# EAGLE design Edin_Usher_V2_0_discreto (EAGLE 9.6.2)
COMPANY: Unexpected Maker; DATE: 24-10-2018; DRAWN: Seon; REV: V1; TITLE: TinyPICO

## Sheet 1 of 3
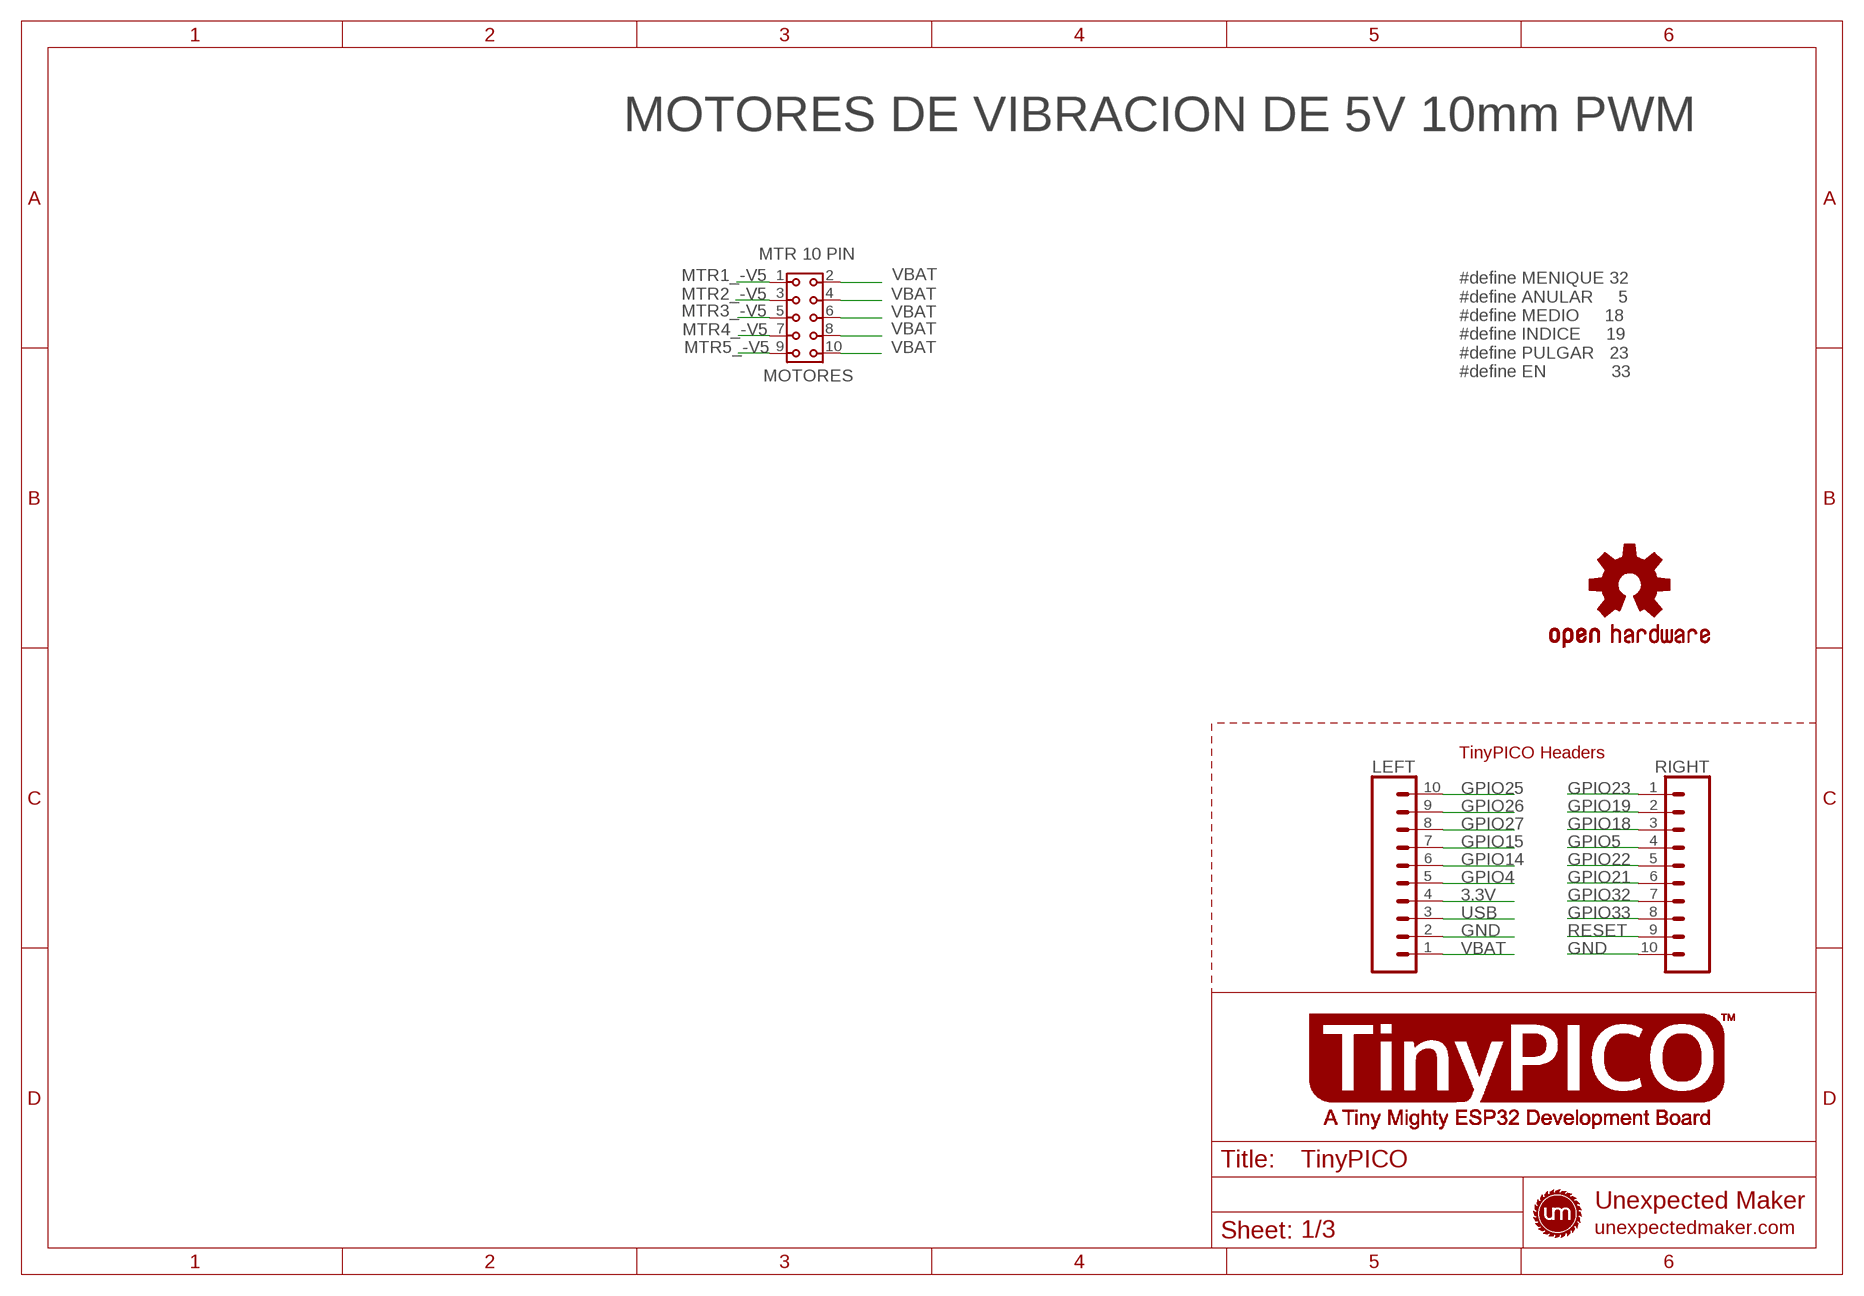
[diagram p0: schematic, sheet 1]

### Parts
LEFT  TINYPICO_HEADER_10NO_SILK_PTH_FEMALE  [1X10_NO_SILK]
LOGO1  OSHW-LOGOS  [OSHW-LOGO-S]
MOTORES  MTR 10 PIN  6130XX21821_61301021821  [61301021821]
RIGHT  TINYPICO_HEADER_10NO_SILK_PTH_FEMALE  [1X10_NO_SILK]

### Nets
3.3V: LEFT.4 ; also sheet 2
GND: LEFT.2 RIGHT.10 ; also sheet 2,3
GPIO4: LEFT.5 ; also sheet 2
GPIO5: RIGHT.4
GPIO14: LEFT.6 ; also sheet 2
GPIO15: LEFT.7 ; also sheet 2
GPIO18: RIGHT.3 ; also sheet 3
GPIO19: RIGHT.2 ; also sheet 3
GPIO21: RIGHT.6 ; also sheet 3
GPIO22: RIGHT.5 ; also sheet 3
GPIO23: RIGHT.1 ; also sheet 3
GPIO25: LEFT.10
GPIO26: LEFT.9
GPIO27: LEFT.8 ; also sheet 2
GPIO32: RIGHT.7
GPIO33: RIGHT.8
MTR1_-V5: MOTORES.1 ; also sheet 3
MTR2_-V5: MOTORES.3 ; also sheet 3
MTR3_-V5: MOTORES.5 ; also sheet 3
MTR4_-V5: MOTORES.7 ; also sheet 3
MTR5_-V5: MOTORES.9 ; also sheet 3
RESET: RIGHT.9 ; also sheet 2
USB: LEFT.3
VBAT: LEFT.1 MOTORES.2 MOTORES.4 MOTORES.6 MOTORES.8 MOTORES.10

### Notes on the sheet
- MOTORES DE VIBRACION DE 5V 10mm PWM
- #define MENIQUE 32
  #define ANULAR     5
  #define MEDIO     18
  #define INDICE     19
  #define PULGAR   23
  #define EN             33
- TinyPICO Headers

## Sheet 2 of 3: Botons
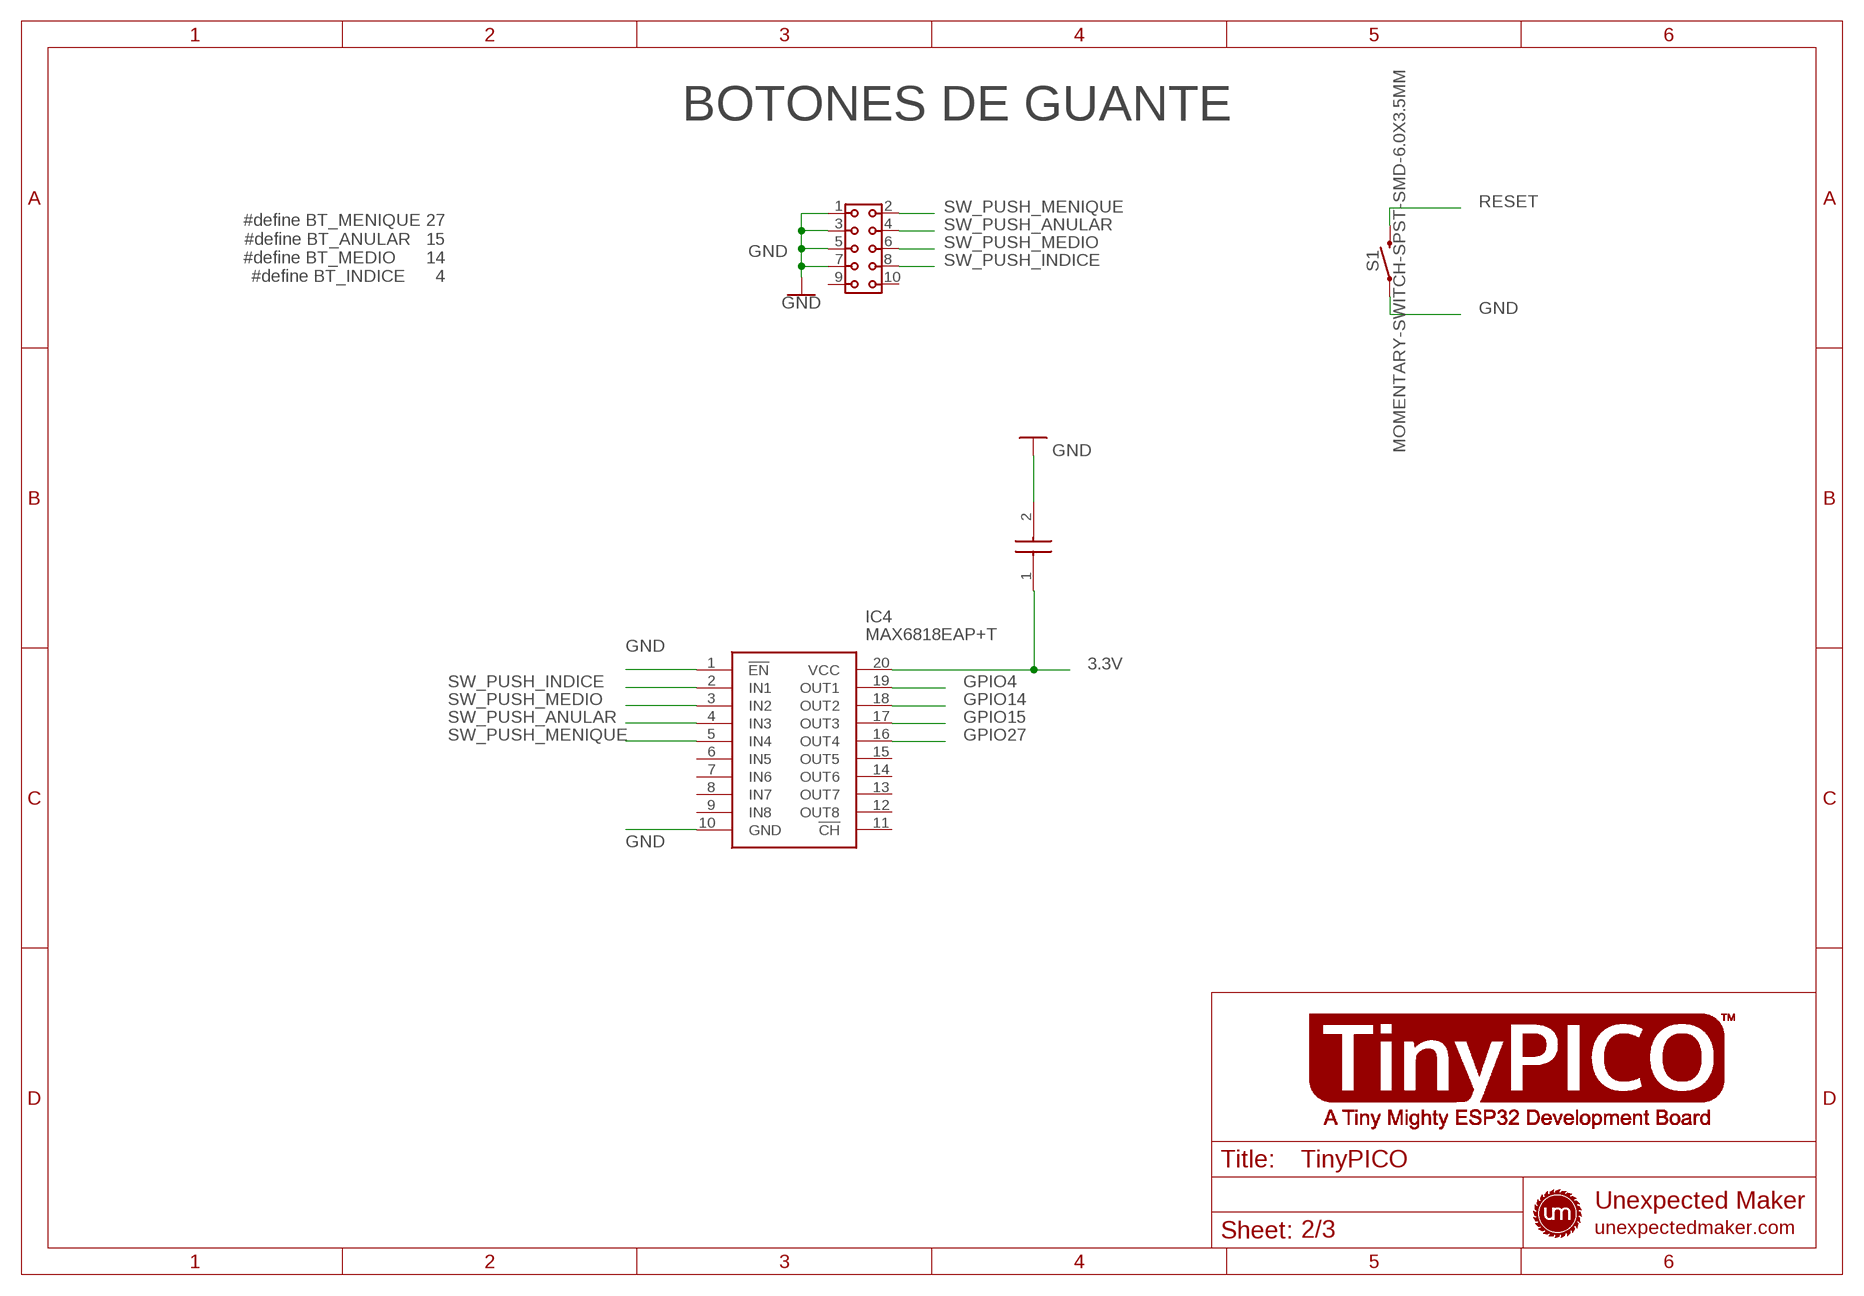
[diagram p1: schematic, sheet 2]

### Parts
BOTONES  BTN 10 PIN  6130XX21821_61301021821  [61301021821]
C8  0603B104K160CT  [CAPC1608X87N]
IC4  MAX6818EAP+T  [SOP65P778X199-20N]
S1  MOMENTARY-SWITCH-SPST-SMD-6.0X3.5MM  [TACTILE_SWITCH_SMD_6.0X3.5MM]

### Nets
3.3V: C8.1 IC4.20(VCC) ; also sheet 1
GND: BOTONES.1 BOTONES.3 BOTONES.5 BOTONES.7 C8.2 IC4.1(!EN) IC4.10(GND) S1.1 ; also sheet 1,3
GPIO4: IC4.19(OUT1) ; also sheet 1
GPIO14: IC4.18(OUT2) ; also sheet 1
GPIO15: IC4.17(OUT3) ; also sheet 1
GPIO27: IC4.16(OUT4) ; also sheet 1
RESET: S1.2 ; also sheet 1
SW_PUSH_ANULAR: BOTONES.4 IC4.4(IN3)
SW_PUSH_INDICE: BOTONES.8 IC4.2(IN1)
SW_PUSH_MEDIO: BOTONES.6 IC4.3(IN2)
SW_PUSH_MENIQUE: BOTONES.2 IC4.5(IN4)
Unconnected: BOTONES.9 BOTONES.10 IC4.6(IN5) IC4.7(IN6) IC4.8(IN7) IC4.9(IN8) IC4.11(!CH) IC4.12(OUT8) IC4.13(OUT7) IC4.14(OUT6) IC4.15(OUT5)

### Notes on the sheet
- BOTONES DE GUANTE
- #define BT_MENIQUE 27
  #define BT_ANULAR   15
  #define BT_MEDIO      14
  #define BT_INDICE      4

## Sheet 3 of 3
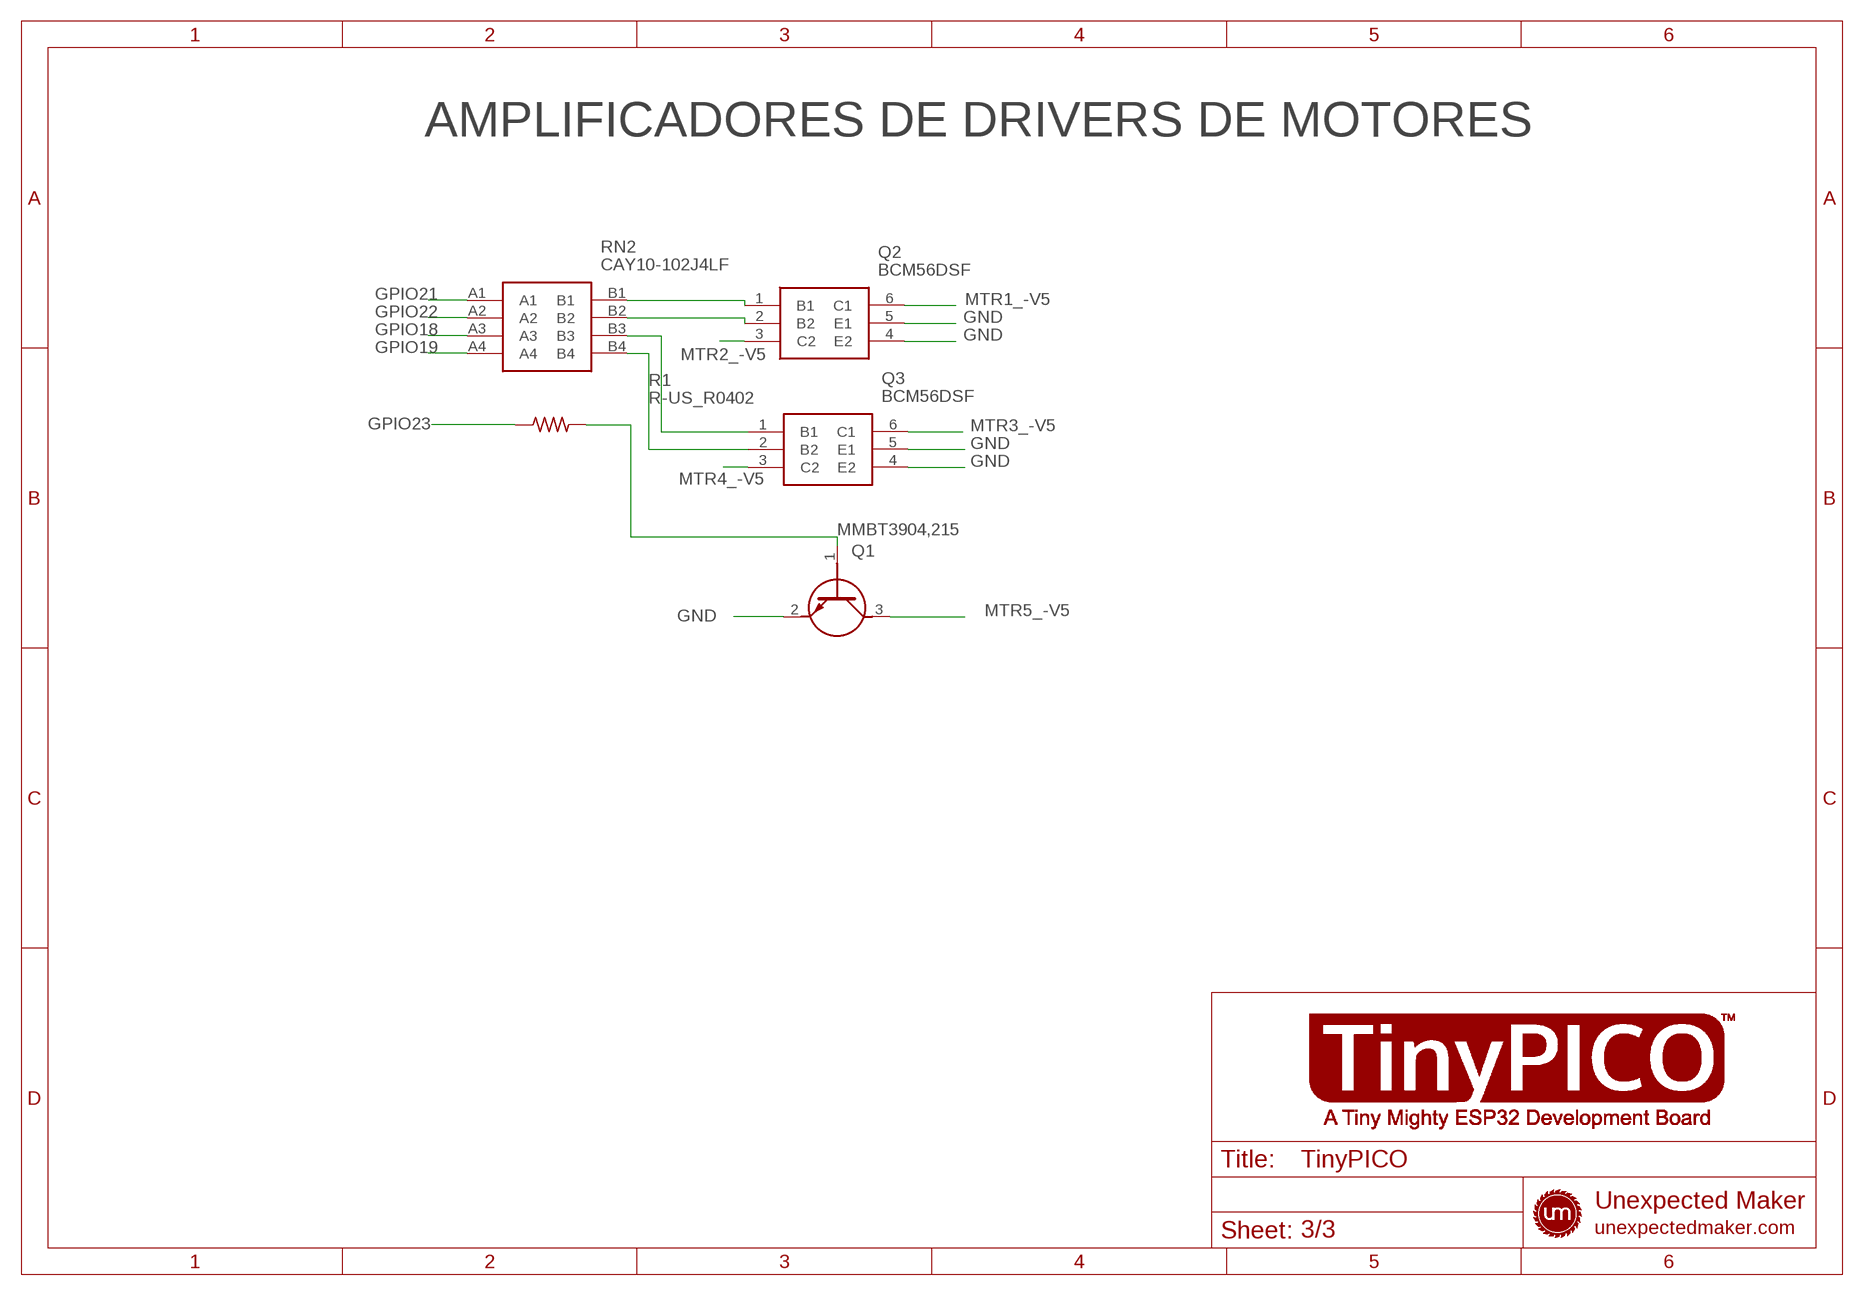
[diagram p2: schematic, sheet 3]

### Parts
Q1  MMBT3904,215  [SOT95P230X110-3N]
Q2  BCM56DSF  [SOT95P275X110-6N]
Q3  BCM56DSF  [SOT95P275X110-6N]
R1  R-US_R0402  [R0402]
RN2  CAY10-102J4LF  [CAY10102J4LF]

### Nets
GND: Q1.2(E) Q2.4(E2) Q2.5(E1) Q3.4(E2) Q3.5(E1) ; also sheet 1,2
GPIO18: RN2.A3 ; also sheet 1
GPIO19: RN2.A4 ; also sheet 1
GPIO21: RN2.A1 ; also sheet 1
GPIO22: RN2.A2 ; also sheet 1
GPIO23: R1.1 ; also sheet 1
MTR1_-V5: Q2.6(C1) ; also sheet 1
MTR2_-V5: Q2.3(C2) ; also sheet 1
MTR3_-V5: Q3.6(C1) ; also sheet 1
MTR4_-V5: Q3.3(C2) ; also sheet 1
MTR5_-V5: Q1.3(C) ; also sheet 1
N$2: Q1.1(B) R1.2
N$6: Q2.1(B1) RN2.B1
N$7: Q2.2(B2) RN2.B2
N$8: Q3.1(B1) RN2.B3
N$9: Q3.2(B2) RN2.B4

### Notes on the sheet
- AMPLIFICADORES DE DRIVERS DE MOTORES

## Library data of the parts
BOTONES MOTORES = Wurth_Connectors_WR-PHD:6130XX21821_61301021821: WR-PHD 2.54 mm Dual Socket Header ARTICLE PROPERTIES: Pins:4;​ 6;​ 8;​ 10;​ 12;​ 14;​ 16;​ 18;​ 20;​ 22;​ 24;​ 26;​ 28;​ 30;​ 32;​ 34;​ 36;​ 40;​ 44;​ 64;​ 72 KIND PROPERTIES: Pitch：2.54 mm Quality Class:3 as per CECC 75 301-802 Rows：Dual Gender：Socket Header Type：Straight MATERIAL PROPERTIES: Insulator Material :PBT Insulator Flammability Rating:UL94 V-0 Contact Material:Copper Alloy Contact Plating:Gold Contact Type:Stamped GENERAL INFORMATION Operating Temperature:-40 up to +125 °C Compliance:Lead free / RoHS ELECTRICAL PROPERTIES: Rated Current:3 A IR 1:3 A Withstanding Voltage:500 V (AC) Contact Resistance:20 mΩ RISO:1000 MΩ CERTIFICATION UL Approval:E323964 PACKAGING PROPERTIES Packaging:Tray <https://katalog.we-online.com/media/images/v2/o57948v209%20Family_Dual_Socket_Header_WR-PHD_6130xx21821.jpg> Details see: https://katalog.we-online.com/en/em/PHD_2_54_DUAL_SOCKET_HEADER_6130XX21821 Updated by Yingchun,Shan 2019-10-21 2019 (C) Würth Elektronik; DATASHEET-URL: https://katalog.we-online.com/em/datasheet/61301021821.pdf; GENDER: Socket Header; IR: 3A; MATES: WR-PHD 2.54mm SMT Dual Pin Header/THT Angled Dual Pin Header/THT Dual Board Stacker/THT Dual Pin Header; PACKAGING: Tray; PART-NUMBER: 61301021821; PINS: 10; ROWS: Dual; TYPE: Straight
C8 = SamacSys_Parts:0603B104K160CT: WALSIN - 0603B104K160CT - CAP, 0.1F, 16V, 10%, X7R, 0603 Source: Datasheet <https://componentsearchengine.com/Datasheets/1/0603B104K160CT.pdf>; DESCRIPTION: WALSIN - 0603B104K160CT - CAP, 0.1F, 16V, 10%, X7R, 0603; HEIGHT: 0.87mm; MANUFACTURER_NAME: Walsin Technology Corporation; MANUFACTURER_PART_NUMBER: 0603B104K160CT; MOUSER_PART_NUMBER: 791-0603B104K160CT; MOUSER_PRICE-STOCK: https://www.mouser.com/Search/Refine.aspx?Keyword=791-0603B104K160CT
IC4 = SamacSys_Parts:MAX6818EAP+T: MAXIM INTEGRATED PRODUCTS - MAX6818EAP+T. - ESD PROTE WITH SWITCH DEBOUNCER, SSOP-20 Source: Datasheet; DESCRIPTION: MAXIM INTEGRATED PRODUCTS - MAX6818EAP+T. - ESD PROTE WITH SWITCH DEBOUNCER, SSOP-20; HEIGHT: 1.99mm; MANUFACTURER_NAME: Maxim Integrated; MANUFACTURER_PART_NUMBER: MAX6818EAP+T; MOUSER_PART_NUMBER: 700-MAX6818EAPT; MOUSER_PRICE-STOCK: https://www.mouser.co.uk/ProductDetail/Maxim-Integrated/MAX6818EAP%2bT?qs=CDqwynd4ZNoKt6d34O8j%252BA%3D%3D
LEFT RIGHT = UnexpectedMaker:TINYPICO_HEADER_10: Multi connection point. Often used as Generic Header-pin footprint for 0.1 inch spaced/style header connections On any of the 0.1 inch spaced packages, you can populate with these: Break Away Headers - Straight <https://www.sparkfun.com/products/116> (PRT-00116) Break Away Male Headers - Right Angle <https://www.sparkfun.com/products/553> (PRT-00553) Female Headers <https://www.sparkfun.com/products/115> (PRT-00115) Break Away Headers - Machine Pin <https://www.sparkfun.com/products/117> (PRT-00117) Break Away Female Headers - Swiss Machine Pin <https://www.sparkfun.com/products/743> (PRT-00743) Arduino Stackable Header - 10 Pin <https://www.sparkfun.com/products/11376> (PRT-11376) For SCREWTERMINALS and SPRING TERMINALS visit here: Screw Terimnals on SparkFun.com <https://www.sparkfun.com/search/results?term=Screw+Terminals> (5mm/3.5mm/2.54mm spacing) This device is also useful as a general connection point to wire up your design to another part of your project. Our various solder wires solder well into these plated through hole pads. Hook-Up Wire - Assortment (Stranded, 22 AWG) <https://www.sparkfun.com/products/11375> (PRT-11375) Hook-Up Wire - Assortment (Solid Core, 22 AWG) <https://www.sparkfun.com/products/11367> (PRT-11367) View the entire wire category on our website here <https://www.sparkfun.com/categories/141> Special notes: Molex polarized connector foot print use with SKU : PRT-08231 with associated crimp pins and housings. 1MM SMD Version SKU: PRT-10208 NOTES ON THE VARIANTS LOCK and LOCK_LONGPADS... This footprint was designed to help hold the alignment of a through-hole component (i.e. 6-pin header) while soldering it into place. You may notice that each hole has been shifted either up or down by 0.005 of an inch from it's more standard position (which is a perfectly straight line). This slight alteration caused the pins (the squares in the middle) to touch the edges of the holes. Because they are alternating, it causes a "brace" to hold the component in place. 0.005 has proven to be the perfect amount of "off-center" position when using our standard breakaway headers. Although looks a little odd when you look at the bare footprint, once you have a header in there, the alteration is very hard to notice. Also,if you push a header all the way into place, it is covered up entirely on the bottom side.; PROD_ID: CONN-11563
LOGO1 = SparkFun-Aesthetics:OSHW-LOGO: Open-Source Hardware (OSHW) Logo This logo indicates the piece of hardware it is found on incorporates a OSHW license and/or adheres to the definition of open source hardware found here: http://freedomdefined.org/OSHW
Q1 = SamacSys_Parts:MMBT3904,215: MMBT3904 - NPN switching transistor Source: Datasheet <http://assets.nexperia.com/documents/data-sheet/MMBT3904.pdf>; DESCRIPTION: MMBT3904 - NPN switching transistor; HEIGHT: 1.1mm; MANUFACTURER_NAME: Nexperia; MANUFACTURER_PART_NUMBER: MMBT3904,215; MOUSER_PART_NUMBER: 771-MMBT3904T/R; MOUSER_PRICE-STOCK: https://www.mouser.co.uk/ProductDetail/Nexperia/MMBT3904215?qs=LOCUfHb8d9s%2FW6hzAJGDbw%3D%3D
Q2 Q3 = SamacSys_Parts:BCM56DSF: Trans GP BJT NPN 80V 1A 500mW Automotive 6-Pin TSOP T/R Source: Datasheet <https://componentsearchengine.com/Datasheets/1/BCM56DSF.pdf>; DESCRIPTION: Trans GP BJT NPN 80V 1A 500mW Automotive 6-Pin TSOP T/R; HEIGHT: 1.1mm; MANUFACTURER_NAME: Nexperia; MANUFACTURER_PART_NUMBER: BCM56DSF; MOUSER_PART_NUMBER: 771-BCM56DSF; MOUSER_PRICE-STOCK: https://www.mouser.com/Search/Refine.aspx?Keyword=771-BCM56DSF
R1 = audio amplifier example:R-US_: RESISTOR, American symbol
RN2 = SamacSys_Parts:CAY10-102J4LF: Bourns CAY10 Series 1k +/-5% Isolated SMT Resistor Array, 4 Resistors, 0.125W total 0804 Package Convex Source: Datasheet <https://componentsearchengine.com/Datasheets/1/CAY10-102J4LF.pdf>; DESCRIPTION: Bourns CAY10 Series 1k +/-5% Isolated SMT Resistor Array, 4 Resistors, 0.125W total 0804 Package Convex; HEIGHT: 0.45mm; MANUFACTURER_NAME: Bourns; MANUFACTURER_PART_NUMBER: CAY10-102J4LF; MOUSER_PART_NUMBER: 652-CAY10-102J4LF; MOUSER_PRICE-STOCK: https://www.mouser.co.uk/ProductDetail/Bourns/CAY10-102J4LF?qs=sGPwja4MK3eTf781t9KvQQ%3D%3D
S1 = SparkFun-Switches:MOMENTARY-SWITCH-SPST: Momentary Switch (Pushbutton) - SPST Normally-open (NO) SPST momentary switches (buttons, pushbuttons). Variants PTH-12MM - 12mm square, through-hole Momentary Pushbutton Switch - 12mm Square <https://www.sparkfun.com/products/9190> (COM-09190) PTH-6.0MM, PTH-6.0MM-KIT - 6.0mm square, through-hole Mini Pushbutton Switch <https://www.sparkfun.com/products/97> (COM-00097) KIT package intended for soldering kit's - only one side of pads' copper is exposed. PTH-RIGHT-ANGLE-KIT - Right-angle, through-hole Right Angle Tactile Button <https://www.sparkfun.com/products/10791> - Used on SparkFun BigTime Watch Kit <https://www.sparkfun.com/products/11734> SMD-12MM - 12mm square, surface-mount Tactile Button - SMD (12mm) <https://www.sparkfun.com/products/12993> (COM-12993) Used on SparkFun PicoBoard <https://www.sparkfun.com/products/11888> SMD-4.5MM - 4.5mm Square Trackball Switch Used on SparkFun Blackberry Trackballer Breakout <https://www.sparkfun.com/products/13169> SMD-4.6MMX2.8MM - 4.60mm x 2.80mm, surface mount Used on SparkFun SAMD21 Mini Breakout <https://www.sparkfun.com/products/13664> SMD-5.2MM, SMD-5.2-REDUNDANT - 5.2mm square, surface-mount Mini Pushbutton Switch - SMD <https://www.sparkfun.com/products/8720> (COM-08720) Used on Arduino Pro Mini <https://www.sparkfun.com/products/11114> REDUNDANT package connects both switch circuits together SMD-6.0X3.5MM - 6.0 x 3.5mm, surface mount Momentary Reset Switch SMD <https://www.sparkfun.com/products/8229> (COM-08229) SMD-6.2MM-TALL - 6.2mm square, surface mount Tactile Button - SMD (6mm) <https://www.sparkfun.com/products/12992> Used on SparkFun Digital Sandbox <https://www.sparkfun.com/products/12651> SMD-RIGHT-ANGLE - Right-angle, surface mount Used on SparkFun Block for Intel® Edison - Arduino <https://www.sparkfun.com/products/13036>; PROD_ID: SWCH-00815; SF_SKU: COM-08229

## Board
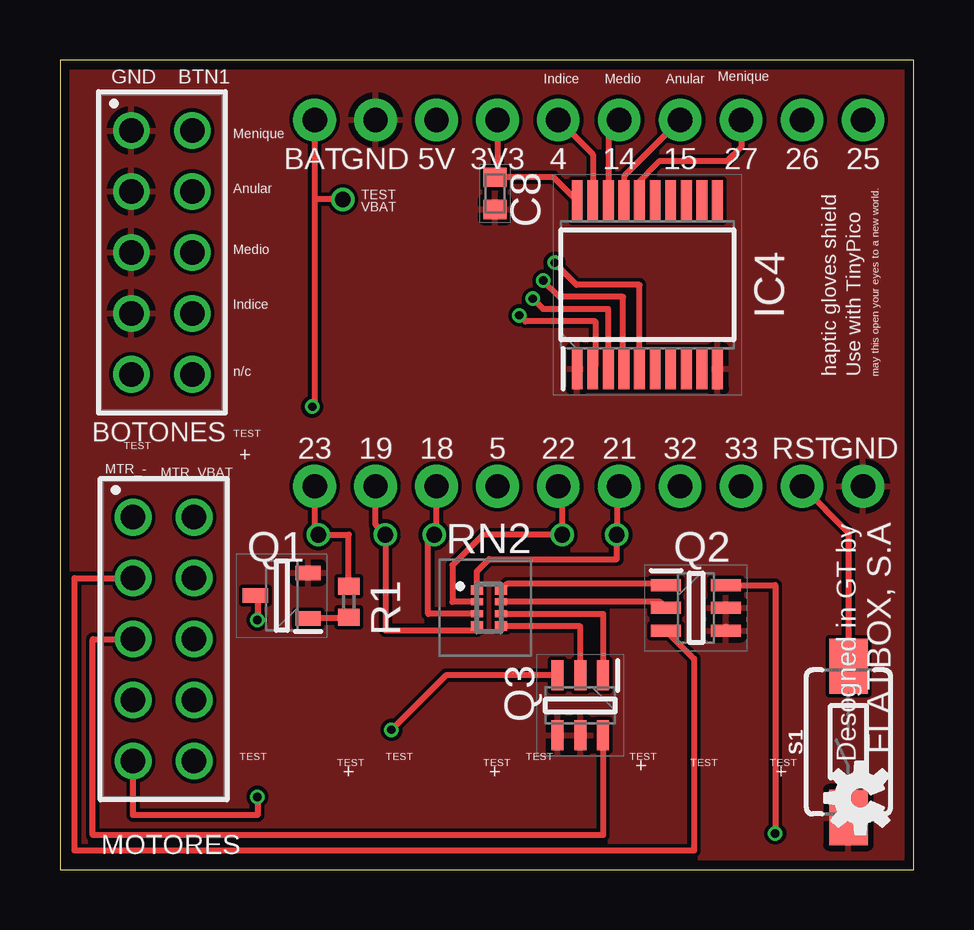
[diagram p3: board, top side]
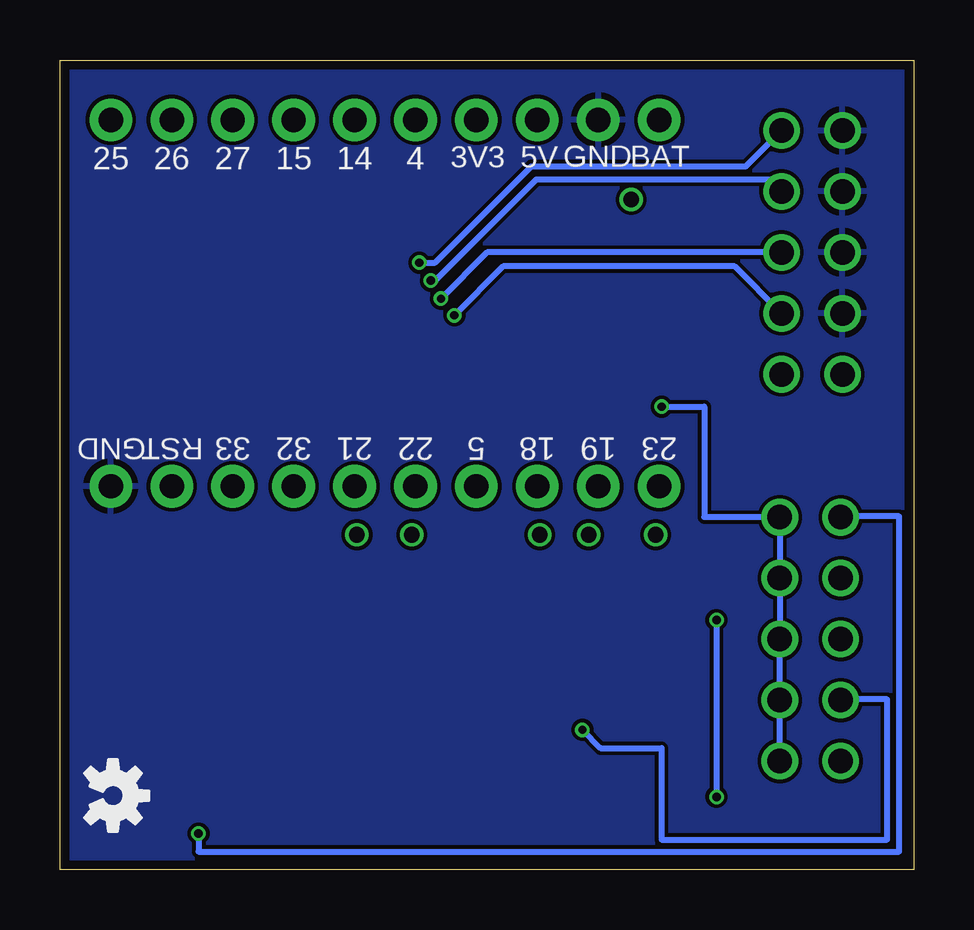
[diagram p4: board, bottom side, seen from below]

Size 35.6 x 33.75 mm. Coordinates in mm from the lower left corner, seen from the top.
Outline: 0,33.75 0,0 35.6,0 35.6,33.75 0,33.75
Copper layers (1*16): Top 0.035559375mm / dielectric 1.6mm / Bottom 0.035559375mm
Design rules "oshpark-2layer": minimum track width 6mil, minimum drill 10mil, track to track 6mil, track to pad 6mil, pad to pad 6mil, via to via 6mil, smd to smd 6mil, copper to edge 15mil, drill to drill 6mil, minimum pad ring 5mil, minimum via ring 5mil, stop-mask expansion 2.5mil, vias tented up to drill 0mil, thermal gap 10mil

### Footprints (pad centres in the part's own frame; a part is rotated, then mirrored left to right if it is on the bottom)
61301021821 = drill 1.02: 1 -5.08,-1.27; 2 -5.08,1.27; 3 -2.54,-1.27; 4 -2.54,1.27; 5 0,-1.27; 6 0,1.27; 7 2.54,-1.27; 8 2.54,1.27; 9 5.08,-1.27; 10 5.08,1.27
CAPC1608X87N = smd 0.8 x 0.94: 1 -0.67,0; 2 0.67,0
SOP65P778X199-20N = smd 1.705 x 0.45: 1 -3.498,2.925; 2 -3.498,2.275; 3 -3.498,1.625; 4 -3.498,0.975; 5 -3.498,0.325; 6 -3.498,-0.325; 7 -3.498,-0.975; 8 -3.498,-1.625; 9 -3.498,-2.275; 10 -3.498,-2.925; 11 3.498,-2.925; 12 3.498,-2.275; 13 3.498,-1.625; 14 3.498,-0.975; 15 3.498,-0.325; 16 3.498,0.325; 17 3.498,0.975; 18 3.498,1.625; 19 3.498,2.275; 20 3.498,2.925
1X10_NO_SILK = drill 1.016 pad 1.778: 1 0,0; 2 2.54,0; 3 5.08,0; 4 7.62,0; 5 10.16,0; 6 12.7,0; 7 15.24,0; 8 17.78,0; 9 20.32,0; 10 22.86,0
SOT95P230X110-3N = smd 1.05 x 0.6: 1 -1.1,0.95; 2 -1.1,-0.95; 3 1.1,0
SOT95P275X110-6N = smd 1.25 x 0.5: 1 -1.25,0.95; 2 -1.25,0; 3 -1.25,-0.95; 4 1.25,-0.95; 5 1.25,0; 6 1.25,0.95
R0402 = smd 0.7 x 0.9: 1 -0.65,0; 2 0.65,0
CAY10102J4LF = smd 0.4 x 0.5: A1 -0.75,-0.5; A4 0.75,-0.5; B1 -0.75,0.5; B4 0.75,0.5 | smd 0.3 x 0.5: A2 -0.25,-0.5; A3 0.25,-0.5; B2 -0.25,0.5; B3 0.25,0.5
TACTILE_SWITCH_SMD_6.0X3.5MM = smd 2.3 x 1.6: 1 -3.15,0; 2 3.15,0

### Placement (x,y rotation side)
BOTONES  4.25,25.73 270 top
C8  18.14,28.19 270 top
IC4  24.49,24.38 90 top
LEFT  10.62,31.25 0 top
LOGO1  33.36,3 90 top
LOGO2  OSHW-LOGOS  [OSHW-LOGO-S]  33.39,3.1 270 bottom
MOTORES  4.32,9.62 270 top
Q1  9.25,11.43 180 top
Q2  26.52,10.92 0 top
Q3  21.69,6.86 270 top
R1  12.04,11.17 270 top
RIGHT  10.62,15.99 0 top
RN2  17.88,10.92 270 top
S1  32.87,5.33 90 top

### Tracks (layer width: path | path; a pad name or v marks a point on that pad's centre or on a via)
3.3V
  Top 0.254: LEFT.4 18.24,28.96 C8.1 20.58,28.86 IC4.20
GND
  Top 0.254: 27.77,10.14 Q2.4
  pour Bottom: 35.63,35.14 35.63,-0.63 -1.02,-0.63 -1.02,35.14
  pour Top: -1.17,35.3 -1.17,-0.76 35.66,-0.76 35.66,35.3
GPIO4
  Top 0.254: LEFT.5 22.21,29.82 IC4.19
GPIO14
  Top 0.254: LEFT.6 22.86,30.8 IC4.18
GPIO15
  Top 0.254: LEFT.7 23.51,28.91 IC4.17
GPIO18  (via drill 0.65)
  Top 0.254: RN2.A3 15.35,10.67 15.35,13.71 15.6,13.95 v15.6,13.97 15.7,14.07 RIGHT.3
GPIO19  (via drill 0.65)
  Top 0.254: RN2.A4 17.38,9.99 13.56,9.99 v13.56,13.97 13.16,14.37 RIGHT.2
GPIO21  (via drill 0.65)
  Top 0.254: RN2.A1 17.38,12.44 17.89,12.95 23.22,12.95 v23.22,13.97 23.22,15.89 RIGHT.6
GPIO22  (via drill 0.65)
  Top 0.254: RN2.A2 16.36,11.17 16.36,12.7 17.63,13.97 v20.93,13.97 20.93,15.84 RIGHT.5
GPIO23  (via drill 0.65)
  Top 0.254: R1.1 12.04,13.97 v10.77,13.97 10.62,13.97 RIGHT.1
GPIO27
  Top 0.254: LEFT.8 28.4,30.13 27.79,29.52 24.98,29.52 24.05,28.59 24.05,27.99 IC4.16
MTR1_-V5  (via drill 0.35)
  Top 0.254: Q2.6 29.82,11.87 v29.82,1.52
  Bottom 0.254: v29.82,1.52 29.82,0.76 0.61,0.76 0.61,14.73 3.05,14.73 MOTORES.1
MTR2_-V5
  Top 0.254: Q2.3 26.43,8.81 26.43,0.8 0.61,0.8 0.61,12.16 MOTORES.3
MTR3_-V5
  Top 0.254: Q3.6 22.64,1.46 1.37,1.46 1.37,9.62 MOTORES.5
MTR4_-V5  (via drill 0.35)
  Top 0.254: Q3.3 16.08,8.11 v13.82,5.84
  Bottom 0.254: v13.82,5.84 13.06,5.08 10.52,5.08 10.52,1.27 1.12,1.27 1.12,7.11 3.05,7.11 MOTORES.7
MTR5_-V5  (via drill 0.35)
  Top 0.254: MOTORES.9 3.05,2.28 8.23,2.28 v8.23,3.05 | Q1.3 8.23,11.43 v8.23,10.41
  Bottom 0.254: v8.23,10.41 v8.23,3.05
N$2
  Top 0.254: R1.2 11.79,10.52 11.74,10.48 Q1.1
N$6
  Top 0.254: Q2.1 25.12,11.87 25.07,11.92 18.64,11.92 RN2.B1
N$7
  Top 0.254: Q2.2 25.02,11.17 RN2.B2
N$8
  Top 0.254: RN2.B3 22.64,10.67 Q3.1
N$9
  Top 0.254: RN2.B4 18.41,10.15 21.69,10.15 Q3.2
RESET
  Top 0.254: RIGHT.9 32.87,14.06 S1.2
SW_PUSH_ANULAR  (via drill 0.35)
  Top 0.254: IC4.4 23.47,20.88 23.47,23.87 20.82,23.87 v20.14,24.56
  Bottom 0.254: v20.14,24.56 19.96,24.56 15.74,28.78 6.02,28.78 BOTONES.4
SW_PUSH_INDICE  (via drill 0.35)
  Top 0.254: IC4.2 22.32,20.99 22.32,22.86 19.41,22.86 v19.15,23.11
  Bottom 0.254: BOTONES.8 7.47,25.14 17.12,25.14 v19.15,23.11
SW_PUSH_MEDIO  (via drill 0.35)
  Top 0.254: IC4.3 22.86,23.37 20.15,23.37 v19.71,23.8
  Bottom 0.254: BOTONES.6 17.79,25.73 v19.71,23.8
SW_PUSH_MENIQUE  (via drill 0.35)
  Top 0.254: IC4.5 24.16,24.38 21.54,24.38 v20.62,25.3
  Bottom 0.254: BOTONES.2 7.01,29.32 15.94,29.32 19.96,25.3 v20.62,25.3
VBAT  (via drill 0.35, 0.65)
  Top 0.254: LEFT.1 10.62,27.94 | v11.79,27.94 10.62,27.94 | v10.52,19.3 10.62,19.4 10.62,27.94
  Bottom 0.254: v10.52,19.3 8.74,19.3 8.74,14.7 MOTORES.2 MOTORES.4 MOTORES.6 MOTORES.8 MOTORES.10

### Text on the board
tPlace: Menique | GND | BTN1 | Indice | Medio | Anular | Menique | Anular | TEST | VBAT | Medio | Indice | n/c | haptic gloves shield | Use with TinyPico | may this open your eyes to a new world. | TEST | TEST | + | Desogned in GT by | TEST | TEST | TEST | TEST | TEST | TEST | TEST | TEST | FLATBOX, S.A | + | + | + | +
tNames: BAT | GND | 5V | 3V3 | 4 | 14 | 15 | 27 | 26 | 25 | 23 | 19 | 18 | 5 | 22 | 21 | 32 | 33 | RST | GND | MTR_- | MTR_VBAT
bNames: BAT | GND | 5V | 3V3 | 4 | 14 | 15 | 27 | 26 | 25 | RST | GND | 23 | 19 | 18 | 5 | 22 | 21 | 32 | 33